# EAGLE design nucleo-block3-a-3 (EAGLE 9.6.2)
AUTHOR: Balazs Racz; DRAWING_TITLE: FREMO 3x Blockplatine; LICENSE: Licensed by the Solderpad Hardware License V2.0; REVIEWER: n/a; REVISION: A1; YEAR: 2024
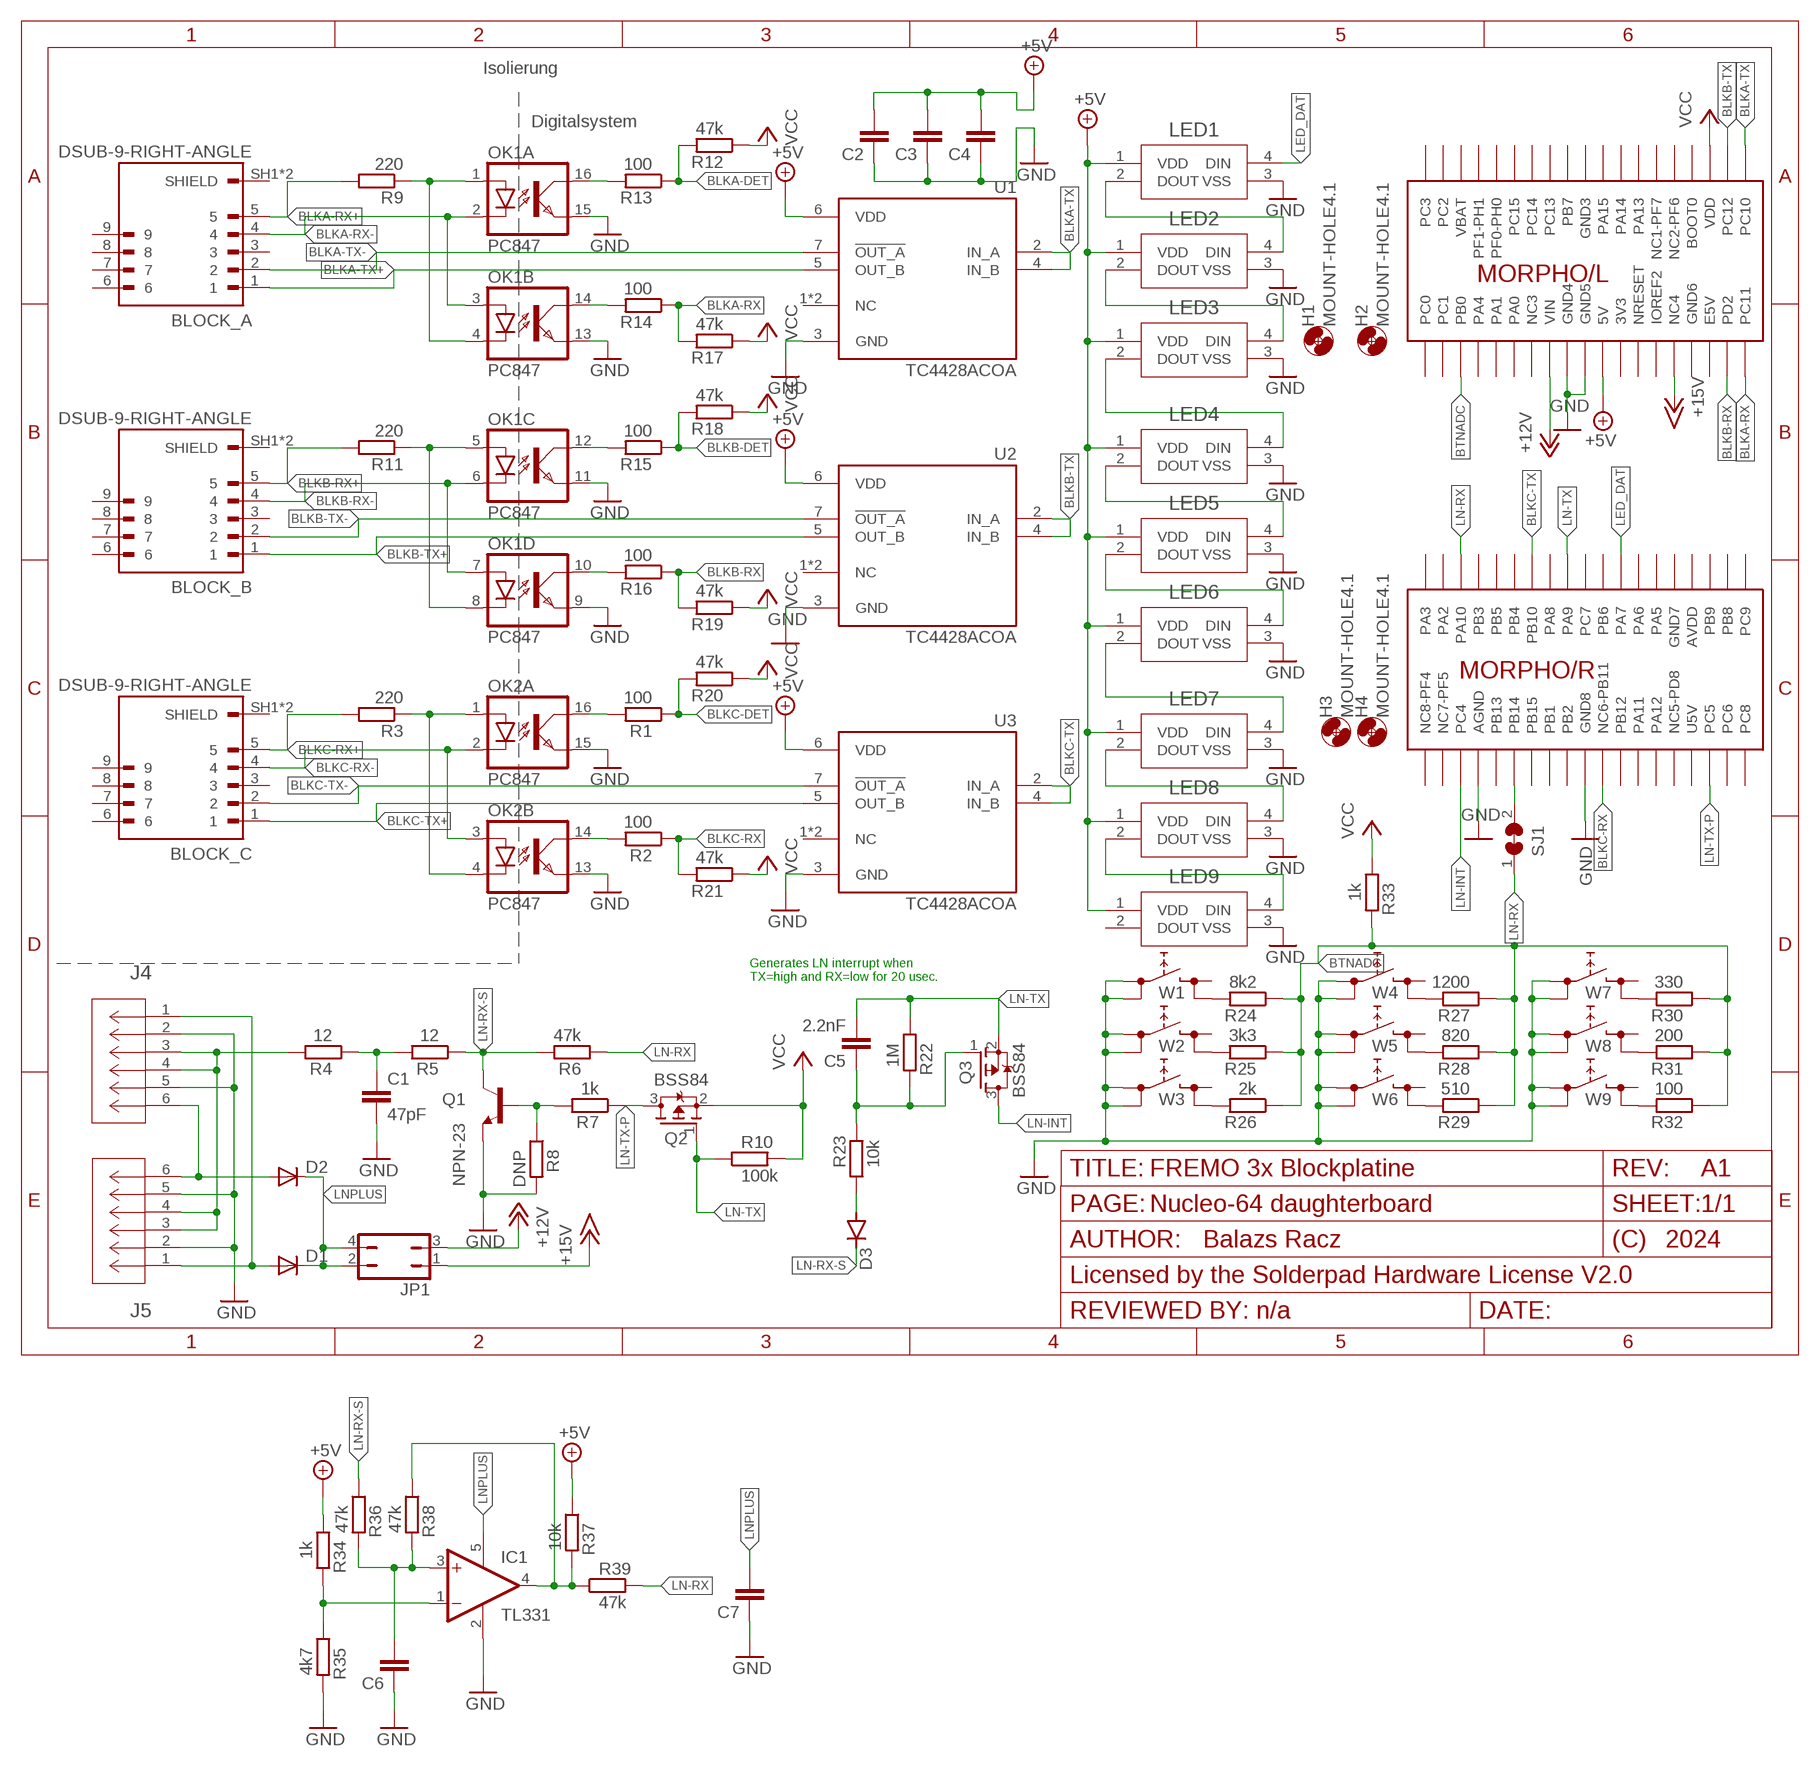
[diagram p0: schematic, sheet 1]
FRAME1 (FRAME_A_L): PAGE: Input ports
FRAME2 (FRAME_A_L): PAGE: Nucleo-64 daughterboard

## Parts
BLOCK_A  DSUB-9-RIGHT-ANGLE  [ASSMANN_A-DS_09_A_KG-T2S]
BLOCK_B  DSUB-9-RIGHT-ANGLE  [ASSMANN_A-DS_09_A_KG-T2S]
BLOCK_C  DSUB-9-RIGHT-ANGLE  [ASSMANN_A-DS_09_A_KG-T2S]
C1  47pF  C-EUC0805  [C0805]
C2  C-EUC0805  [C0805]
C3  C-EUC0805  [C0805]
C4  C-EUC0805  [C0805]
C5  2.2nF  C-EUC0805  [C0805]
C6  C-EUC0805  [C0805]
C7  C-EUC0805  [C0805]
D1  DIODEDO-214AA-NODOC  [DO214AA-NODOC]
D2  DIODEDO-214AA-NODOC  [DO214AA-NODOC]
D3  DIODE-MINIMELF  [MINIMELF]
G1  NUCLEO_64_GENERIC  [NUCLEO_BRD_BASE64]
H1  MOUNT-HOLE4.1  [4,1]
H2  MOUNT-HOLE4.1  [4,1]
H3  MOUNT-HOLE4.1  [4,1]
H4  MOUNT-HOLE4.1  [4,1]
IC1  TL331  [DBV-R-PDSO-G5]
J4  MODJACK6P6C-MJ3245-66-0CONN_MJ3245-66-0_GCT  [CONN_MJ3245-66-0_GCT]
J5  MODJACK6P6C-MJ3245-66-0CONN_MJ3245-66-0_GCT  [CONN_MJ3245-66-0_GCT]
JP1  JP2Q  [JP2Q]
LED1  LED-2812BCOM-16347_SPK-M  [COM-16347_SPK-M]
LED2  LED-2812BCOM-16347_SPK-M  [COM-16347_SPK-M]
LED3  LED-2812BCOM-16347_SPK-M  [COM-16347_SPK-M]
LED4  LED-2812BCOM-16347_SPK-M  [COM-16347_SPK-M]
LED5  LED-2812BCOM-16347_SPK-M  [COM-16347_SPK-M]
LED6  LED-2812BCOM-16347_SPK-M  [COM-16347_SPK-M]
LED7  LED-2812BCOM-16347_SPK-M  [COM-16347_SPK-M]
LED8  LED-2812BCOM-16347_SPK-M  [COM-16347_SPK-M]
LED9  LED-2812BCOM-16347_SPK-M  [COM-16347_SPK-M]
OK1  PC847  [DIL16]
OK2  PC847  [DIL16]
Q1  NPN-23  [SOT23]
Q2  BSS84  [SOT23-PCH]
Q3  BSS84  [SOT23-PCH]
R1  100  R-EU_R0805  [R0805]
R2  100  R-EU_R0805  [R0805]
R3  220  R-EU_R0805  [R0805]
R4  12  R-EU_R0805  [R0805]
R5  12  R-EU_R0805  [R0805]
R6  47k  R-EU_R0805  [R0805]
R7  1k  R-EU_R0805  [R0805]
R8  DNP  R-EU_R0805  [R0805]
R9  220  R-EU_R0805  [R0805]
R10  100k  R-EU_R0805  [R0805]
R11  220  R-EU_R0805  [R0805]
R12  47k  R-EU_R0805  [R0805]
R13  100  R-EU_R0805  [R0805]
R14  100  R-EU_R0805  [R0805]
R15  100  R-EU_R0805  [R0805]
R16  100  R-EU_R0805  [R0805]
R17  47k  R-EU_R0805  [R0805]
R18  47k  R-EU_R0805  [R0805]
R19  47k  R-EU_R0805  [R0805]
R20  47k  R-EU_R0805  [R0805]
R21  47k  R-EU_R0805  [R0805]
R22  1M  R-EU_R0805  [R0805]
R23  10k  R-EU_R0805  [R0805]
R24  8k2  R-EU_R0603  [R0603]
R25  3k3  R-EU_R0603  [R0603]
R26  2k  R-EU_R0603  [R0603]
R27  1200  R-EU_R0603  [R0603]
R28  820  R-EU_R0603  [R0603]
R29  510  R-EU_R0603  [R0603]
R30  330  R-EU_R0603  [R0603]
R31  200  R-EU_R0603  [R0603]
R32  100  R-EU_R0603  [R0603]
R33  1k  R-EU_R0805  [R0805]
R34  1k  R-EU_R0805  [R0805]
R35  4k7  R-EU_R0805  [R0805]
R36  47k  R-EU_R0805  [R0805]
R37  10k  R-EU_R0805  [R0805]
R38  47k  R-EU_R0805  [R0805]
R39  47k  R-EU_R0805  [R0805]
SJ1  SJ-C  [SJW-C]
U1  TC4428ACOA  [SOIC127P600X175-8N]
U2  TC4428ACOA  [SOIC127P600X175-8N]
U3  TC4428ACOA  [SOIC127P600X175-8N]
W1  W1  TACTSW-6X6S  [TACTSW-6X6]
W2  W1  TACTSW-6X6S  [TACTSW-6X6]
W3  W1  TACTSW-6X6S  [TACTSW-6X6]
W4  W1  TACTSW-6X6S  [TACTSW-6X6]
W5  W1  TACTSW-6X6S  [TACTSW-6X6]
W6  W1  TACTSW-6X6S  [TACTSW-6X6]
W7  W1  TACTSW-6X6S  [TACTSW-6X6]
W8  W1  TACTSW-6X6S  [TACTSW-6X6]
W9  W1  TACTSW-6X6S  [TACTSW-6X6]

## Nets
+5V: C2.2 C3.2 C4.2 G1.5V2(5V) LED1.1(VDD) LED2.1(VDD) LED3.1(VDD) LED4.1(VDD) LED5.1(VDD) LED6.1(VDD) LED7.1(VDD) LED8.1(VDD) LED9.1(VDD) R34.1 R37.1 U1.6(VDD) U2.6(VDD) U3.6(VDD)
+12V: G1.VIN2(VIN) JP1.3
+15V: G1.NC4 JP1.1
BLKA-DET: R12.2 R13.1
BLKA-RX: G1.PC11 R14.1 R17.2
BLKA-RX+: BLOCK_A.5 R9.2
BLKA-RX-: BLOCK_A.4 OK1.2(A:C) OK1.3(B:A)
BLKA-TX: G1.PC10 U1.2(IN_A) U1.4(IN_B)
BLKA-TX+: BLOCK_A.1 U1.5(OUT_B)
BLKA-TX-: BLOCK_A.2 U1.7(!OUT_A)
BLKB-DET: R15.1 R18.2
BLKB-RX: G1.PD2 R16.1 R19.2
BLKB-RX+: BLOCK_B.5 R11.2
BLKB-RX-: BLOCK_B.4 OK1.6(C:C) OK1.7(D:A)
BLKB-TX: G1.PC12 U2.2(IN_A) U2.4(IN_B)
BLKB-TX+: BLOCK_B.1 U2.5(OUT_B)
BLKB-TX-: BLOCK_B.2 U2.7(!OUT_A)
BLKC-DET: R1.1 R20.2
BLKC-RX: G1.NC6-PB11 R2.1 R21.2
BLKC-RX+: BLOCK_C.5 R3.2
BLKC-RX-: BLOCK_C.4 OK2.2(A:C) OK2.3(B:A)
BLKC-TX: G1.PB10 U3.2(IN_A) U3.4(IN_B)
BLKC-TX+: BLOCK_C.1 U3.5(OUT_B)
BLKC-TX-: BLOCK_C.2 U3.7(!OUT_A)
BTNADC: G1.PB0 R24.1 R25.1 R26.1 R27.1 R28.1 R29.1 R30.1 R31.1 R32.1 R33.2
GND: C1.2 C2.1 C3.1 C4.1 C6.1 C7.1 G1.AGND G1.GND4 G1.GND5 G1.GND8 IC1.2(GND) J4.2 J4.5 J5.2 J5.5 LED1.3(VSS) LED2.3(VSS) LED3.3(VSS) LED4.3(VSS) LED5.3(VSS) LED6.3(VSS) LED7.3(VSS) LED8.3(VSS) LED9.3(VSS) OK1.9(D:EMIT) OK1.11(C:EMIT) OK1.13(B:EMIT) OK1.15(A:EMIT) OK2.13(B:EMIT) OK2.15(A:EMIT) Q1.2(E) R8.2 R35.2 U1.3(GND) U2.3(GND) U3.3(GND) W1.1(1.1) W1.2(1.2) W2.1(1.1) W2.2(1.2) W3.1(1.1) W3.2(1.2) W4.1(1.1) W4.2(1.2) W5.1(1.1) W5.2(1.2) W6.1(1.1) W6.2(1.2) W7.1(1.1) W7.2(1.2) W8.1(1.1) W8.2(1.2) W9.1(1.1) W9.2(1.2)
LED_DAT: G1.PA7 LED1.4(DIN)
LN-INT: G1.PC4 Q3.3(D)
LN-RX: G1.PA10 R6.1 R39.2 SJ1.1
LN-RX-S: D3.C Q1.3(C) R5.1 R6.2 R36.1
LN-TX: C5.2 G1.PA9 Q2.1(G) Q3.2(S) R10.1 R22.1
LN-TX-P: G1.PC5 Q2.3(D) R7.1
LNPLUS: C7.2 D1.C D2.C IC1.5(V+) JP1.2 JP1.4
N$1: OK2.1(A:A) OK2.4(B:C) R3.1
N$2: OK2.16(A:COL) R1.2
N$3: OK2.14(B:COL) R2.2
N$4: D2.A J4.6 J5.6
N$5: C1.1 R4.1 R5.2
N$6: D1.A J4.1 J5.1
N$7: J4.3 J4.4 J5.3 J5.4 R4.2
N$8: IC1.1(-IN) R34.2 R35.1
N$9: R24.2 W1.4(2.2)
N$10: D3.A R23.1
N$11: Q1.1(B) R7.2 R8.1
N$12: LED1.2(DOUT) LED2.4(DIN)
N$13: LED2.2(DOUT) LED3.4(DIN)
N$14: LED3.2(DOUT) LED4.4(DIN)
N$15: LED4.2(DOUT) LED5.4(DIN)
N$16: LED5.2(DOUT) LED6.4(DIN)
N$17: LED6.2(DOUT) LED7.4(DIN)
N$18: LED7.2(DOUT) LED8.4(DIN)
N$19: LED8.2(DOUT) LED9.4(DIN)
N$20: G1.PB14 SJ1.2
N$21: R25.2 W2.4(2.2)
N$22: C5.1 Q3.1(G) R22.2 R23.2
N$23: R26.2 W3.4(2.2)
N$24: C6.2 IC1.3(+IN) R36.2 R38.2
N$25: IC1.4(OUT) R37.2 R38.1 R39.1
N$26: R27.2 W4.4(2.2)
N$27: R28.2 W5.4(2.2)
N$28: R29.2 W6.4(2.2)
N$31: OK1.1(A:A) OK1.4(B:C) R9.1
N$32: R30.2 W7.4(2.2)
N$33: R31.2 W8.4(2.2)
N$34: R32.2 W9.4(2.2)
N$35: OK1.5(C:A) OK1.8(D:C) R11.1
N$41: OK1.16(A:COL) R13.2
N$42: OK1.14(B:COL) R14.2
N$43: OK1.12(C:COL) R15.2
N$44: OK1.10(D:COL) R16.2
VCC: G1.VDD Q2.2(S) R10.2 R12.1 R17.1 R18.1 R19.1 R20.1 R21.1 R33.1
Unconnected: BLOCK_A.3 BLOCK_A.6 BLOCK_A.7 BLOCK_A.8 BLOCK_A.9 BLOCK_A.SH1(SHIELD) BLOCK_A.SH2(SHIELD) BLOCK_B.3 BLOCK_B.6 BLOCK_B.7 BLOCK_B.8 BLOCK_B.9 BLOCK_B.SH1(SHIELD) BLOCK_B.SH2(SHIELD) BLOCK_C.3 BLOCK_C.6 BLOCK_C.7 BLOCK_C.8 BLOCK_C.9 BLOCK_C.SH1(SHIELD) BLOCK_C.SH2(SHIELD) G1.BOOT0 G1.IOREF2 G1.NC1-PF7 G1.NC2-PF6 G1.NC3 G1.NC5-PD8 G1.NC7-PF5 G1.NC8-PF4 G1.NRESET G1.PA0 G1.PA1 G1.PA2 G1.PA3 G1.PA4 G1.PA5 G1.PA6 G1.PA8 G1.PA11 G1.PA12 G1.PA13 G1.PA14 G1.PA15 G1.PB1 G1.PB2 G1.PB3 G1.PB4 G1.PB5 G1.PB6 G1.PB7 G1.PB8 G1.PB9 G1.PB12 G1.PB13 G1.PB15 G1.PC0 G1.PC1 G1.PC2 G1.PC3 G1.PC6 G1.PC7 G1.PC8 G1.PC9 G1.PC13 G1.PC14 G1.PC15 G1.PF0-PH0 G1.PF1-PH1 LED9.2(DOUT) OK2.5(C:A) OK2.6(C:C) OK2.7(D:A) OK2.8(D:C) OK2.9(D:EMIT) OK2.10(D:COL) OK2.11(C:EMIT) OK2.12(C:COL) U1.1(NC) U1.8(NC) U2.1(NC) U2.8(NC) U3.1(NC) U3.8(NC) W1.3(2.1) W2.3(2.1) W3.3(2.1) W4.3(2.1) W5.3(2.1) W6.3(2.1) W7.3(2.1) W8.3(2.1) W9.3(2.1)

## Notes on the sheet
- Isolierung
- Digitalsystem
- Generates LN interrupt when
  TX=high and RX=low for 20 usec.

## Power pins joined to a net without a drawn wire
3V3: G1.3V3
AVDD: G1.AVDD
E5V: G1.E5V
GND3: G1.GND3
GND6: G1.GND6
GND7: G1.GND7
U5V: G1.U5V
VBAT: G1.VBAT

## Library data of the parts
BLOCK_A BLOCK_B BLOCK_C = eagleparts:DSUB-9-RIGHT-ANGLE: A-DS_09_A_KG-T2S Female: digikey AE10921-ND Male: digikey AE10968-ND; MANUFACTURER: Assmann WSW Components; MAXIMUM_PACKAGE_HEIGHT: 12.8mm; PARTREV: 10; STANDARD: Manufacturer recommendations
C1-C7 = rcl:C-EU: CAPACITOR, European symbol; SPICEPREFIX: C
D1 D2 = trainlib:DIODE
D3 = diode:DIODE-: DIODE
G1 = eagleparts:NUCLEO_64_GENERIC
H1-H4 = holes:MOUNT-HOLE: MOUNTING HOLE with drill center marker
IC1 = linear:TL331: SINGLE DIFFERENTIAL COMPARATOR Source: Data sheet <http://www.ti.com/lit/ds/symlink/tl331-q1.pdf>
J4 J5 = eagleparts:MODJACK6P6C-MJ3245-66-0: 6p6c modular jack digikey: 2073-MJ3245-66-0-ND; COPYRIGHT: Copyright (C) 2024 Ultra Librarian. All rights reserved.; MANUFACTURER_PART_NUMBER: MJ3245-66-0; MFR_NAME: Global Connector Technology; TYPE: Modular Connector Jacks
JP1 = jumper:JP2Q: JUMPER
LED1-LED9 = eagleparts:LED-2812B; COPYRIGHT: Copyright (C) 2024 Ultra Librarian. All rights reserved.; MANUFACTURER_PART_NUMBER: COM-16347; MFR_NAME: Sparkfun; TYPE: LED Addressable
OK1 OK2 = optocoupler:PC847: SHARP OPTO COUPLER; OC_FARNELL: 9707735; OC_NEWARK: unknown
Q1 = eagleparts:NPN-23
Q2 Q3 = eagleparts:BSS84: P-CHANNEL MOS FET
R1-R39 = rcl:R-EU_: RESISTOR, European symbol; SPICEPREFIX: R
SJ1 = eagleparts:SJ-C
U1-U3 = eagleparts:TC4428ACOA: Low-Side Gate Driver IC Inverting, Non-Inverting 8-SOIC; MANUFACTURER: Microchip; MAXIMUM_PACKAGE_HEIGHT: 1.75 mm; PARTREV: J; STANDARD: IPC 7351B
W1-W9 = g-e2e-training:TACTSW-6X6: 6.2 X 6.5mm TACT Switch (SMD) Source: http://www3.alps.co.jp/WebObjects/catalog.woa/PDF/E/Switch/Tact/SKHM/SKHM.PDF

## Net classes
0 default: width 0.254 mm, clearance 0.203 mm

## Board
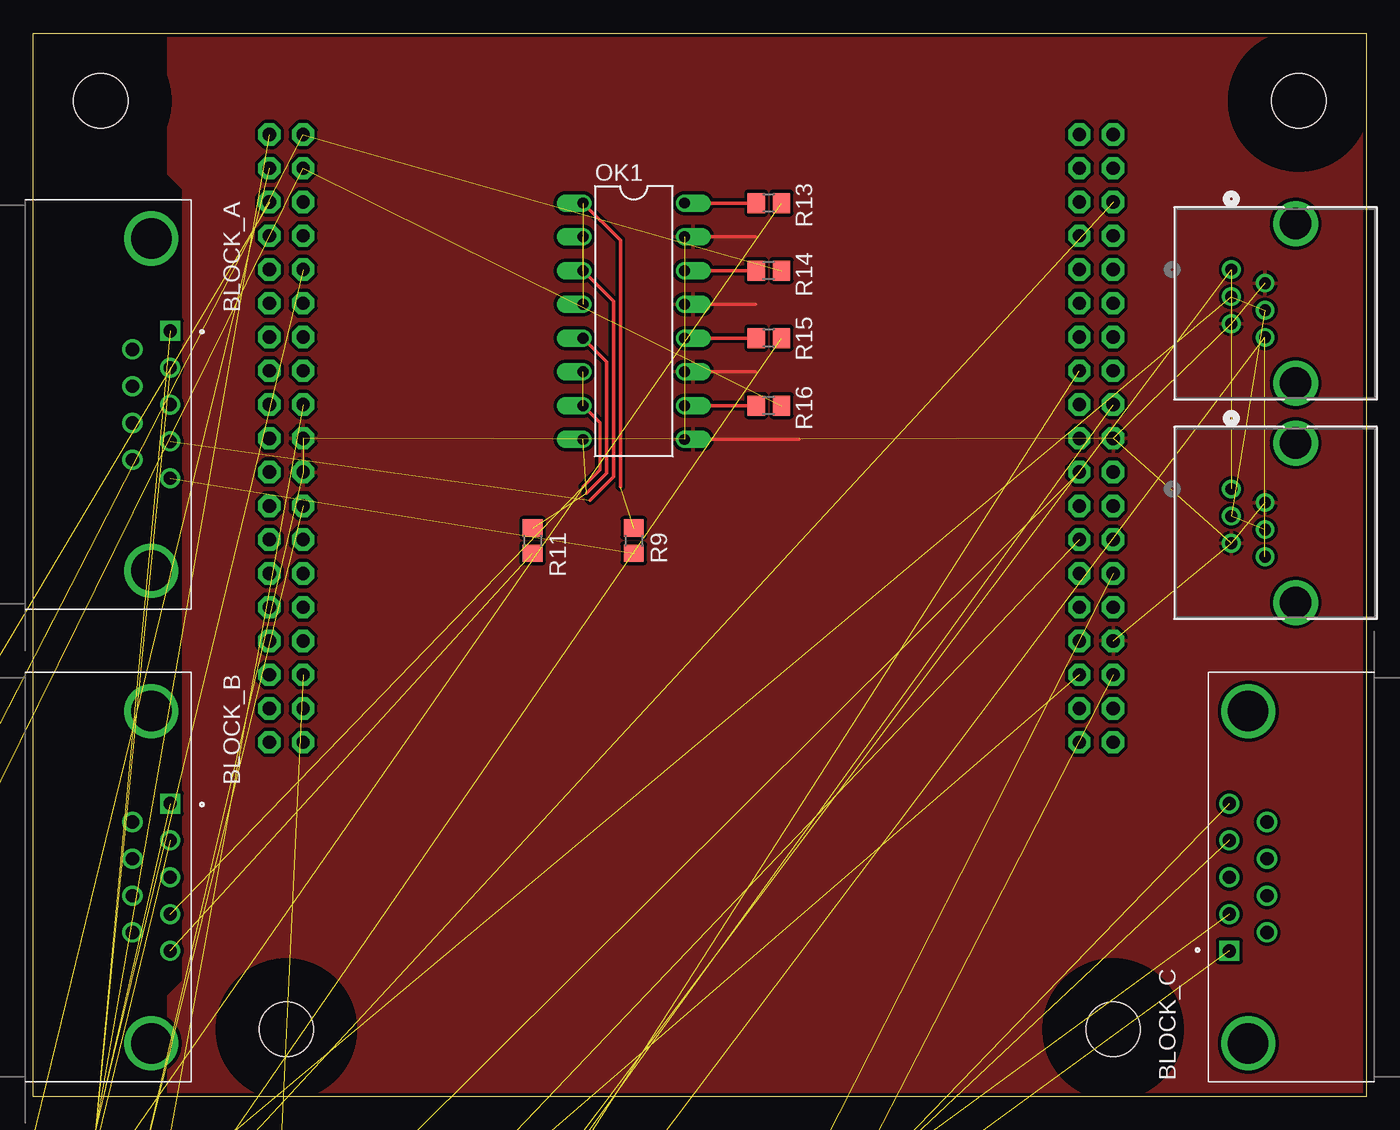
[diagram p1: board, top side]
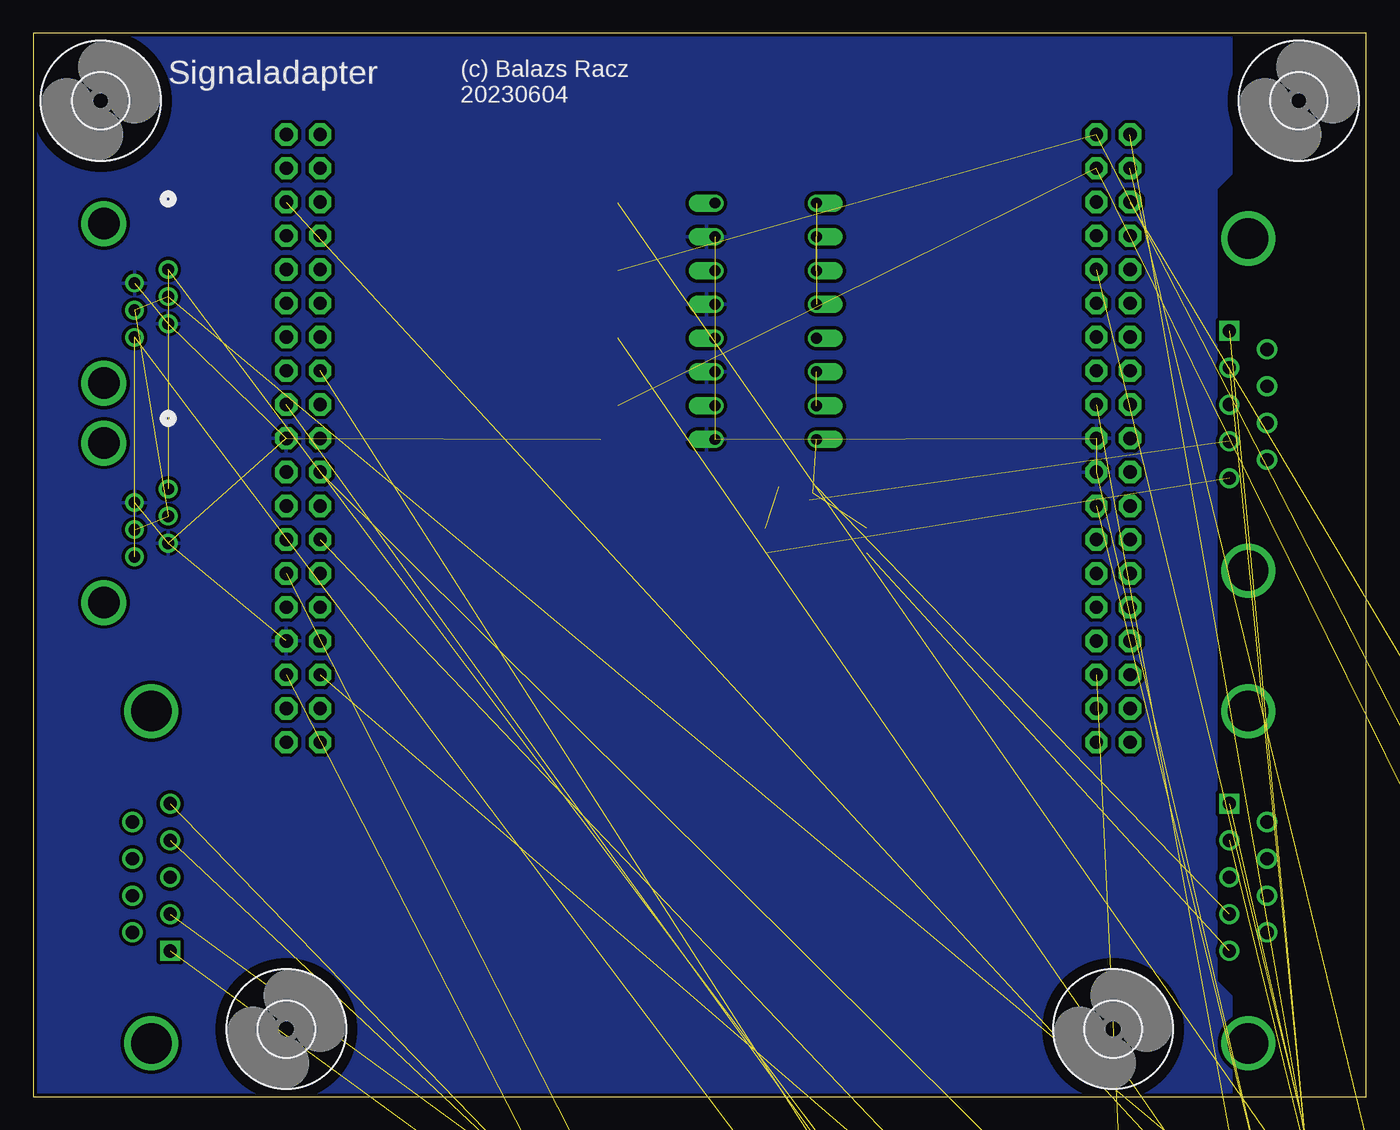
[diagram p2: board, bottom side, seen from below]

Size 100.33 x 80.01 mm. Coordinates in mm from the lower left corner, seen from the top.
Outline: 100.33,0 0,0 0,80.01 100.33,80 100.33,0
Copper layers (1*16): Top 0.035mm / dielectric 1.5mm / Bottom 0.035mm
Design rules "SeeedStudio_2layer_DRU_no_angle_20140221": minimum track width 6mil, minimum drill 12mil, track to track 6mil, track to pad 6mil, pad to pad 6mil, via to via 6mil, smd to smd 0mil, copper to edge 10mil, drill to drill 10mil, minimum pad ring 10mil, minimum via ring 6mil, stop-mask expansion 2mil, vias tented up to drill 100mil, thermal gap 10mil

### Footprints (pad centres in the part's own frame; a part is rotated, then mirrored left to right if it is on the bottom)
ASSMANN_A-DS_09_A_KG-T2S = drill 1 square: 1 -5.54,1.42 | drill 1: 2 -2.77,1.42; 3 0,1.42; 4 2.77,1.42; 5 5.54,1.42; 6 -4.155,-1.42; 7 -1.385,-1.42; 8 1.385,-1.42; 9 4.155,-1.42 | drill 3.05: SH1 -12.495,0; SH2 12.495,0
C0805 = smd 1.3 x 1.5: 1 -0.95,0; 2 0.95,0
DO214AA-NODOC = smd 1.8 x 2.2: A 2.55,0; C -2.55,0
MINIMELF = smd 1.4 x 1.8: A 1.7,0; C -1.7,0
NUCLEO_BRD_BASE64 = drill 1 pad 1.676 octagon: 3V3 2.54,27.94; 5V2 2.54,25.4; AGND 63.5,7.62; AVDD 60.96,38.1; BOOT0 0,38.1; E5V 2.54,40.64; GND3 0,22.86; GND4 2.54,20.32; GND5 2.54,22.86; GND6 2.54,38.1; GND7 60.96,35.56; GND8 63.5,22.86; IOREF2 2.54,33.02; NC1-PF7 0,33.02; NC2-PF6 0,35.56; NC3 2.54,15.24; NC4 2.54,35.56; NC5-PD8 63.5,35.56; NC6-PB11 63.5,25.4; NC7-PF5 63.5,2.54; NC8-PF4 63.5,0; NRESET 2.54,30.48; PA0 2.54,12.7; PA1 2.54,10.16; PA2 60.96,2.54; PA3 60.96,0; PA4 2.54,7.62; PA5 60.96,33.02; PA6 60.96,30.48; PA7 60.96,27.94; PA8 60.96,17.78; PA9 60.96,20.32; PA10 60.96,5.08; PA11 63.5,30.48; PA12 63.5,33.02; PA13 0,30.48; PA14 0,27.94; PA15 0,25.4; PB0 2.54,5.08; PB1 63.5,17.78; PB2 63.5,20.32; PB3 60.96,7.62; PB4 60.96,12.7; PB5 60.96,10.16; PB6 60.96,25.4; PB7 0,20.32; PB8 60.96,43.18; PB9 60.96,40.64; PB10 60.96,15.24; PB12 63.5,27.94; PB13 63.5,10.16; PB14 63.5,12.7; PB15 63.5,15.24; PC0 2.54,0; PC1 2.54,2.54; PC2 0,2.54; PC3 0,0; PC4 63.5,5.08; PC5 63.5,40.64; PC6 63.5,43.18; PC7 60.96,22.86; PC8 63.5,45.72; PC9 60.96,45.72; PC10 0,45.72; PC11 2.54,45.72; PC12 0,43.18; PC13 0,17.78; PC14 0,15.24; PC15 0,12.7; PD2 2.54,43.18; PF0-PH0 0,10.16; PF1-PH1 0,7.62; U5V 63.5,38.1; VBAT 0,5.08; VDD 0,40.64; VIN2 2.54,17.78
4,1 = hole 4.1: 0,0
DBV-R-PDSO-G5 = smd 0.6 x 1.2: 1 -0.95,-1.306; 2 0,-1.306; 3 0.95,-1.306; 4 0.95,1.306; 5 -0.95,1.306
CONN_MJ3245-66-0_GCT = drill 0.889 pad 1.397: 1 0,0; 2 -1.02,-2.54; 3 -2.04,0; 4 -3.06,-2.54; 5 -4.08,0; 6 -5.1,-2.54 | drill 2.362 pad 2.362: 7 -8.55,-4.84; 8 3.45,-4.84
JP2Q = drill 0.914 octagon: 1 -1.27,-1.27; 2 -1.27,1.27; 3 1.27,-1.27; 4 1.27,1.27
COM-16347_SPK-M = smd 1.549 x 0.94: 1 -2.489,1.65; 2 -2.489,-1.65; 3 2.489,-1.65; 4 2.489,1.65
DIL16 = drill 0.813 offset: 1 -8.89,-3.81; 2 -6.35,-3.81; 3 -3.81,-3.81; 4 -1.27,-3.81; 5 1.27,-3.81; 6 3.81,-3.81; 7 6.35,-3.81; 8 8.89,-3.81; 9 8.89,3.81; 10 6.35,3.81; 11 3.81,3.81; 12 1.27,3.81; 13 -1.27,3.81; 14 -3.81,3.81; 15 -6.35,3.81; 16 -8.89,3.81
SOT23 = smd 1 x 1.4: 1 -0.95,-1.1; 2 0.95,-1.1; 3 0,1.1
SOT23-PCH = smd 1 x 1.4: 1 -0.95,-1.1; 2 0.95,-1.1; 3 0,1.1
R0805 = smd 1.3 x 1.5: 1 -0.95,0; 2 0.95,0
R0603 = smd 1 x 1.1: 1 -0.85,0; 2 0.85,0
SJW-C = smd 1.27 x 2.54: 1 -1.27,0; 2 1.27,0
SOIC127P600X175-8N = smd 1.9 x 0.6: 1 -2.455,1.905; 2 -2.455,0.635; 3 -2.455,-0.635; 4 -2.455,-1.905; 5 2.455,-1.905; 6 2.455,-0.635; 7 2.455,0.635; 8 2.455,1.905
TACTSW-6X6 = smd 2.1 x 1.4: 1 -4.55,2.24; 2 4.55,2.25; 3 -4.55,-2.25; 4 4.55,-2.25

### Placement (x,y rotation side)
BLOCK_A  8.89,52.07 270 top
BLOCK_B  8.89,16.51 270 top
BLOCK_C  91.44,16.51 90 top
C1  -104.14,-114.3 0 top  (outside the outline)
C2  -111.76,-367.03 0 top  (outside the outline)
C3  -111.76,-372.11 0 top  (outside the outline)
C4  -111.76,-377.19 0 top  (outside the outline)
C5  -111.76,-382.27 0 top  (outside the outline)
C6  -128.27,-560.07 0 top  (outside the outline)
C7  -128.27,-565.15 0 top  (outside the outline)
D1  -109.22,-199.39 0 top  (outside the outline)
D2  -109.22,-207.01 0 top  (outside the outline)
D3  -110.49,-355.6 0 top  (outside the outline)
G1  17.78,26.67 0 top
H1  5.08,74.93 0 bottom
H2  19.05,5.08 0 bottom
H3  81.28,5.08 0 bottom
H4  95.25,74.93 0 bottom
IC1  -127,-521.97 0 top  (outside the outline)
J4  90.17,62.23 90 top
J5  90.17,45.72 90 top
JP1  -119.38,-519.43 0 top  (outside the outline)
LED1  -97.79,-218.44 0 top  (outside the outline)
LED2  -68.58,-218.44 0 top  (outside the outline)
LED3  -97.79,-242.57 0 top  (outside the outline)
LED4  -68.58,-242.57 0 top  (outside the outline)
LED5  -97.79,-266.7 0 top  (outside the outline)
LED6  -68.58,-266.7 0 top  (outside the outline)
LED7  -97.79,-290.83 0 top  (outside the outline)
LED8  -68.58,-290.83 0 top  (outside the outline)
LED9  -97.79,-314.96 0 top  (outside the outline)
OK1  45.2,58.34 270 top
OK2  -14,-78 0 top  (outside the outline)
Q1  -104.14,-119.38 0 top  (outside the outline)
Q2  -104.14,-134.62 0 top  (outside the outline)
Q3  -110.49,-341.63 0 top  (outside the outline)
R1  -24,-88 0 top  (outside the outline)
R2  -19,-88 0 top  (outside the outline)
R3  -24,-95 0 top  (outside the outline)
R4  -104.14,-101.6 0 top  (outside the outline)
R5  -104.14,-107.95 0 top  (outside the outline)
R6  -104.14,-127 0 top  (outside the outline)
R7  -104.14,-142.24 0 top  (outside the outline)
R8  -104.14,-148.59 0 top  (outside the outline)
R9  45.2,41.83 270 top
R10  -104.14,-154.94 0 top  (outside the outline)
R11  37.58,41.83 270 top
R12  -104.14,-161.29 0 top  (outside the outline)
R13  55.36,67.23 180 top
R14  55.36,62.15 180 top
R15  55.36,57.07 180 top
R16  55.36,51.99 180 top
R17  -104.14,-167.64 0 top  (outside the outline)
R18  -104.14,-173.99 0 top  (outside the outline)
R19  -104.14,-180.34 0 top  (outside the outline)
R20  -104.14,-186.69 0 top  (outside the outline)
R21  -104.14,-193.04 0 top  (outside the outline)
R22  -111.76,-349.25 0 top  (outside the outline)
R23  -111.76,-360.68 0 top  (outside the outline)
R24  -0.85,-433.07 0 top  (outside the outline)
R25  -111.76,-439.42 0 top  (outside the outline)
R26  -111.76,-444.5 0 top  (outside the outline)
R27  -100.33,-469.9 0 top  (outside the outline)
R28  -111.76,-480.06 0 top  (outside the outline)
R29  -106.68,-480.06 0 top  (outside the outline)
R30  -100.33,-505.46 0 top  (outside the outline)
R31  -111.76,-515.62 0 top  (outside the outline)
R32  -106.68,-515.62 0 top  (outside the outline)
R33  -111.76,-521.97 0 top  (outside the outline)
R34  -128.27,-528.32 0 top  (outside the outline)
R35  -128.27,-534.67 0 top  (outside the outline)
R36  -128.27,-541.02 0 top  (outside the outline)
R37  -128.27,-547.37 0 top  (outside the outline)
R38  -128.27,-553.72 0 top  (outside the outline)
R39  -128.27,-570.23 0 top  (outside the outline)
SJ1  -110.49,-335.28 0 top  (outside the outline)
U1  -4,-67 0 top  (outside the outline)
U2  -13,-67 0 top  (outside the outline)
U3  -22,-67 0 top  (outside the outline)
W1  -107.95,-391.16 0 top  (outside the outline)
W2  -107.95,-401.32 0 top  (outside the outline)
W3  -107.95,-411.48 0 top  (outside the outline)
W4  -107.95,-452.12 0 top  (outside the outline)
W5  -107.95,-462.28 0 top  (outside the outline)
W6  -107.95,-472.44 0 top  (outside the outline)
W7  -107.95,-487.68 0 top  (outside the outline)
W8  -107.95,-497.84 0 top  (outside the outline)
W9  -107.95,-508 0 top  (outside the outline)

### Tracks (layer width: path | path; a pad name or v marks a point on that pad's centre or on a via)
+5V  (17 unrouted)
+12V  (1 unrouted)
+15V  (1 unrouted)
BLKA-DET  (1 unrouted)
BLKA-RX  (2 unrouted)
BLKA-RX+  (1 unrouted)
BLKA-RX-  (2 unrouted)
  Top 0.254: 41.9,44.88 43.68,46.66 43.68,59.86 OK1.3
BLKA-TX  (2 unrouted)
BLKA-TX+  (1 unrouted)
BLKA-TX-  (1 unrouted)
BLKB-DET  (1 unrouted)
BLKB-RX  (2 unrouted)
BLKB-RX+  (1 unrouted)
BLKB-RX-  (2 unrouted)
  Top 0.254: 41.39,45.89 42.66,47.16 42.66,50.72 OK1.7
BLKB-TX  (2 unrouted)
BLKB-TX+  (1 unrouted)
BLKB-TX-  (1 unrouted)
BLKC-DET  (1 unrouted)
BLKC-RX  (2 unrouted)
BLKC-RX+  (1 unrouted)
BLKC-RX-  (2 unrouted)
BLKC-TX  (2 unrouted)
BLKC-TX+  (1 unrouted)
BLKC-TX-  (1 unrouted)
BTNADC  (10 unrouted)
GND  (53 unrouted)
  Top 0.254: OK1.15 54.34,64.69 | OK1.13 54.34,59.61 | OK1.11 54.34,54.53 | 57.65,49.45 OK1.9
  pour Bottom (isolate 0.254): 100.08,79.76 100.08,0.25 10.08,0.25 10.08,7.54 11.21,8.67 11.21,68.29 10.08,69.42 10.08,79.76
  pour Top (isolate 0.254): 100.08,0.25 100.08,79.76 10.08,79.76 10.08,69.42 11.21,68.29 11.21,8.67 10.08,7.54 10.08,0.25
LED_DAT  (1 unrouted)
LN-INT  (1 unrouted)
LN-RX  (3 unrouted)
LN-RX-S  (4 unrouted)
LN-TX  (5 unrouted)
LN-TX-P  (2 unrouted)
LNPLUS  (5 unrouted)
N$1  (2 unrouted)
N$2  (1 unrouted)
N$3  (1 unrouted)
N$4  (2 unrouted)
N$5  (2 unrouted)
N$6  (2 unrouted)
N$7  (4 unrouted)
N$8  (2 unrouted)
N$9  (1 unrouted)
N$10  (1 unrouted)
N$11  (2 unrouted)
N$12  (1 unrouted)
N$13  (1 unrouted)
N$14  (1 unrouted)
N$15  (1 unrouted)
N$16  (1 unrouted)
N$17  (1 unrouted)
N$18  (1 unrouted)
N$19  (1 unrouted)
N$20  (1 unrouted)
N$21  (1 unrouted)
N$22  (3 unrouted)
N$23  (1 unrouted)
N$24  (3 unrouted)
N$25  (3 unrouted)
N$26  (1 unrouted)
N$27  (1 unrouted)
N$28  (1 unrouted)
N$31  (2 unrouted)
  Top 0.254: 44.18,45.89 44.18,64.44 OK1.1
N$32  (1 unrouted)
N$33  (1 unrouted)
N$34  (1 unrouted)
N$35  (2 unrouted)
  Top 0.254: 41.64,45.39 43.17,46.91 43.17,55.29 OK1.5
N$41
  Top 0.254: R13.2 OK1.16
N$42
  Top 0.254: R14.2 OK1.14
N$43
  Top 0.254: R15.2 OK1.12
N$44
  Top 0.254: R16.2 OK1.10
VCC  (9 unrouted)

### Text on the board
bNames: Signaladapter | (c) Balazs Racz / 20230604 | F1 / RM | ora/w| | Masse | ora| | F2 / RM | gn/w| | Masse | gn| | bl| | H / RM | bl/w| | br/w| | br|